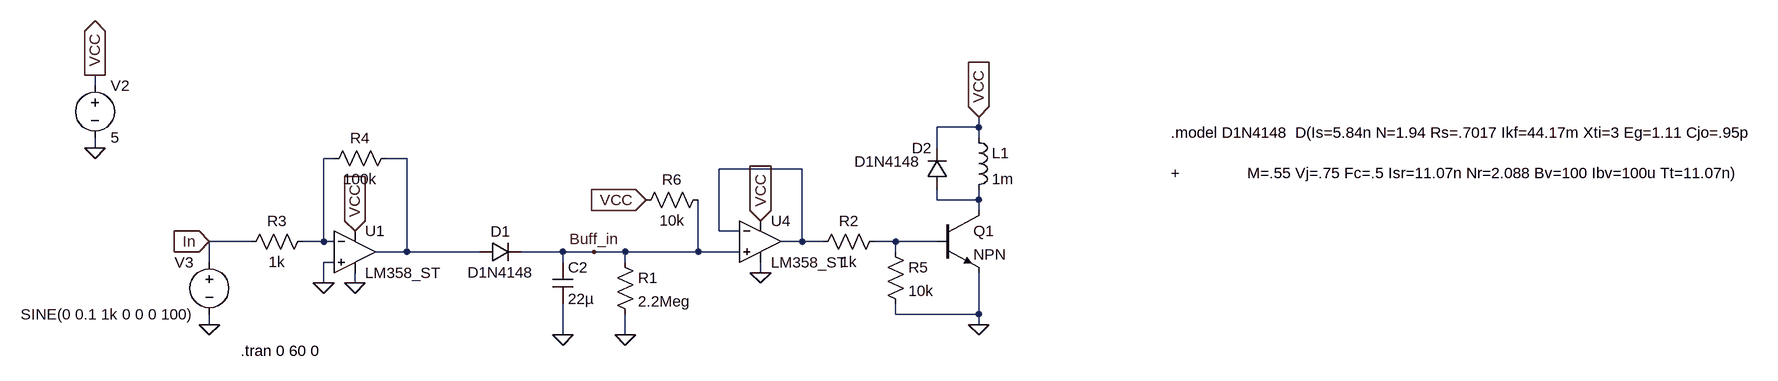
[diagram p0: schematic Audio Sensor.asc]
Audio Sensor.asc, the LTspice schematic file:
Version 4
SHEET 1 2276 680
WIRE -288 -96 -288 -112
WIRE 1072 -32 1072 -48
WIRE 1072 -32 1008 -32
WIRE 1072 -16 1072 -32
WIRE -288 0 -288 -16
WIRE 1008 0 1008 -32
WIRE 80 16 64 16
WIRE 192 16 160 16
WIRE 800 32 672 32
WIRE 1008 80 1008 64
WIRE 1072 80 1072 64
WIRE 1072 80 1008 80
WIRE 1072 96 1072 80
WIRE 672 128 672 32
WIRE 704 128 672 128
WIRE -48 144 -112 144
WIRE 64 144 64 16
WIRE 64 144 32 144
WIRE 80 144 64 144
WIRE 800 144 800 32
WIRE 800 144 768 144
WIRE 832 144 800 144
WIRE 944 144 912 144
WIRE 1008 144 944 144
WIRE 192 160 192 16
WIRE 192 160 144 160
WIRE 304 160 192 160
WIRE 432 160 368 160
WIRE 480 160 432 160
WIRE 528 160 480 160
WIRE 640 160 640 80
WIRE 640 160 528 160
WIRE 704 160 640 160
WIRE 944 160 944 144
WIRE -112 176 -112 144
WIRE 80 176 64 176
WIRE 432 176 432 160
WIRE 528 176 528 160
WIRE 736 192 736 176
WIRE 64 208 64 176
WIRE 112 208 112 192
WIRE 944 256 944 240
WIRE 1072 256 1072 192
WIRE 1072 256 944 256
WIRE -112 272 -112 256
WIRE 1072 272 1072 256
WIRE 432 288 432 240
WIRE 528 288 528 256
FLAG -112 272 0
FLAG 112 128 VCC
IOPIN 112 128 In
FLAG 432 288 0
FLAG -112 144 In
IOPIN -112 144 In
FLAG -288 -112 VCC
IOPIN -288 -112 Out
FLAG -288 0 0
FLAG 480 160 Buff_in
FLAG 1072 272 0
FLAG 1072 -48 VCC
IOPIN 1072 -48 In
FLAG 736 112 VCC
IOPIN 736 112 In
FLAG 736 192 0
FLAG 528 288 0
FLAG 64 208 0
FLAG 112 208 0
FLAG 560 80 VCC
IOPIN 560 80 In
SYMBOL diode 304 176 R270
WINDOW 0 32 32 VTop 2
WINDOW 3 0 32 VBottom 2
SYMATTR InstName D1
SYMATTR Value D1N4148
SYMBOL cap 416 176 R0
SYMATTR InstName C2
SYMATTR Value 22µ
SYMBOL res 48 128 R90
WINDOW 0 0 56 VBottom 2
WINDOW 3 32 56 VTop 2
SYMATTR InstName R3
SYMATTR Value 1k
SYMBOL res 64 32 R270
WINDOW 0 32 56 VTop 2
WINDOW 3 0 56 VBottom 2
SYMATTR InstName R4
SYMATTR Value 100k
SYMBOL voltage -288 -112 R0
WINDOW 123 0 0 Left 0
WINDOW 39 24 124 Left 2
SYMATTR InstName V2
SYMATTR Value 5
SYMBOL voltage -112 160 M0
WINDOW 123 0 0 Left 0
WINDOW 39 0 0 Left 0
SYMATTR InstName V3
SYMATTR Value SINE(0 0.1 1k 0 0 0 100)
SYMBOL res 928 128 R90
WINDOW 0 0 56 VBottom 2
WINDOW 3 32 56 VTop 2
SYMATTR InstName R2
SYMATTR Value 1k
SYMBOL res 928 144 R0
SYMATTR InstName R5
SYMATTR Value 10k
SYMBOL npn 1008 96 R0
SYMATTR InstName Q1
SYMBOL ind 1056 -32 R0
SYMATTR InstName L1
SYMATTR Value 1m
SYMATTR SpiceLine Rser=63
SYMBOL diode 1024 64 R180
WINDOW 0 24 64 Left 2
WINDOW 3 41 43 Left 2
SYMATTR InstName D2
SYMATTR Value D1N4148
SYMBOL res 512 160 R0
SYMATTR InstName R1
SYMATTR Value 2.2Meg
SYMBOL ZZZ\\OpAmp\\LM358_ST 736 144 R0
SYMATTR InstName U4
SYMBOL ZZZ\\OpAmp\\LM358_ST 112 160 R0
SYMATTR InstName U1
SYMBOL res 656 64 R90
WINDOW 0 0 56 VBottom 2
WINDOW 3 32 56 VTop 2
SYMATTR InstName R6
SYMATTR Value 10k
TEXT -64 312 Left 2 !.tran 0 60 0
TEXT 1368 -24 Left 2 !.model D1N4148  D(Is=5.84n N=1.94 Rs=.7017 Ikf=44.17m Xti=3 Eg=1.11 Cjo=.95p\n\n+               M=.55 Vj=.75 Fc=.5 Isr=11.07n Nr=2.088 Bv=100 Ibv=100u Tt=11.07n)

The netlist it stands for:
* Audio Sensor.asc
D1 N002 Buff_in D1N4148
C2 Buff_in 0 22µ
R3 N001 In 1k
R4 N001 N002 100k
V2 VCC 0 5
V3 In 0 SINE(0 0.1 1k 0 0 0 100)
R2 N005 N003 1k
R5 N005 0 10k
Q1 N004 N005 0 0 NPN
L1 VCC N004 1m Rser=63
D2 N004 VCC D1N4148
R1 Buff_in 0 2.2Meg
* U4: LM358_ST (symbol ZZZ\OpAmp\LM358_ST not available, pins judged from their places): In+=Buff_in In-=N003 V+=VCC V-=0 OUT=N003
* U1: LM358_ST (symbol ZZZ\OpAmp\LM358_ST not available, pins judged from their places): In+=0 In-=N001 V+=VCC V-=0 OUT=N002
R6 Buff_in VCC 10k
.model D D
.lib standard.dio
.model NPN NPN
.model PNP PNP
.lib standard.bjt
.tran 0 60 0
.model D1N4148  D(Is=5.84n N=1.94 Rs=.7017 Ikf=44.17m Xti=3 Eg=1.11 Cjo=.95p
+               M=.55 Vj=.75 Fc=.5 Isr=11.07n Nr=2.088 Bv=100 Ibv=100u Tt=11.07n)
.backanno
.end